# EAGLE board hub_keyboard (EAGLE 9.2.1)
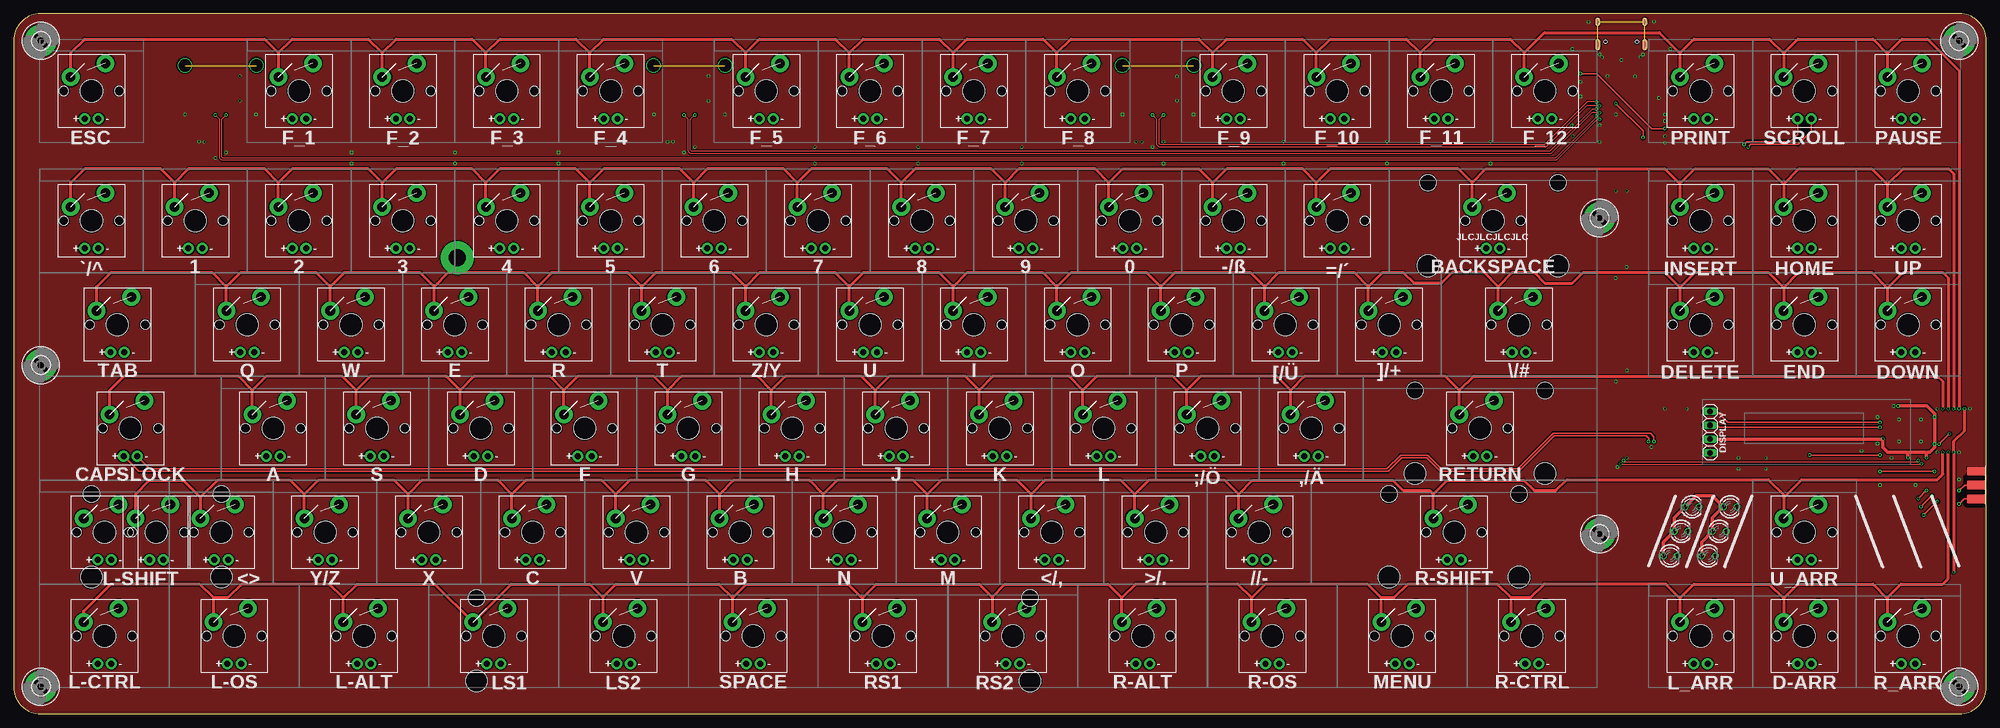
[diagram p4: board, top side]
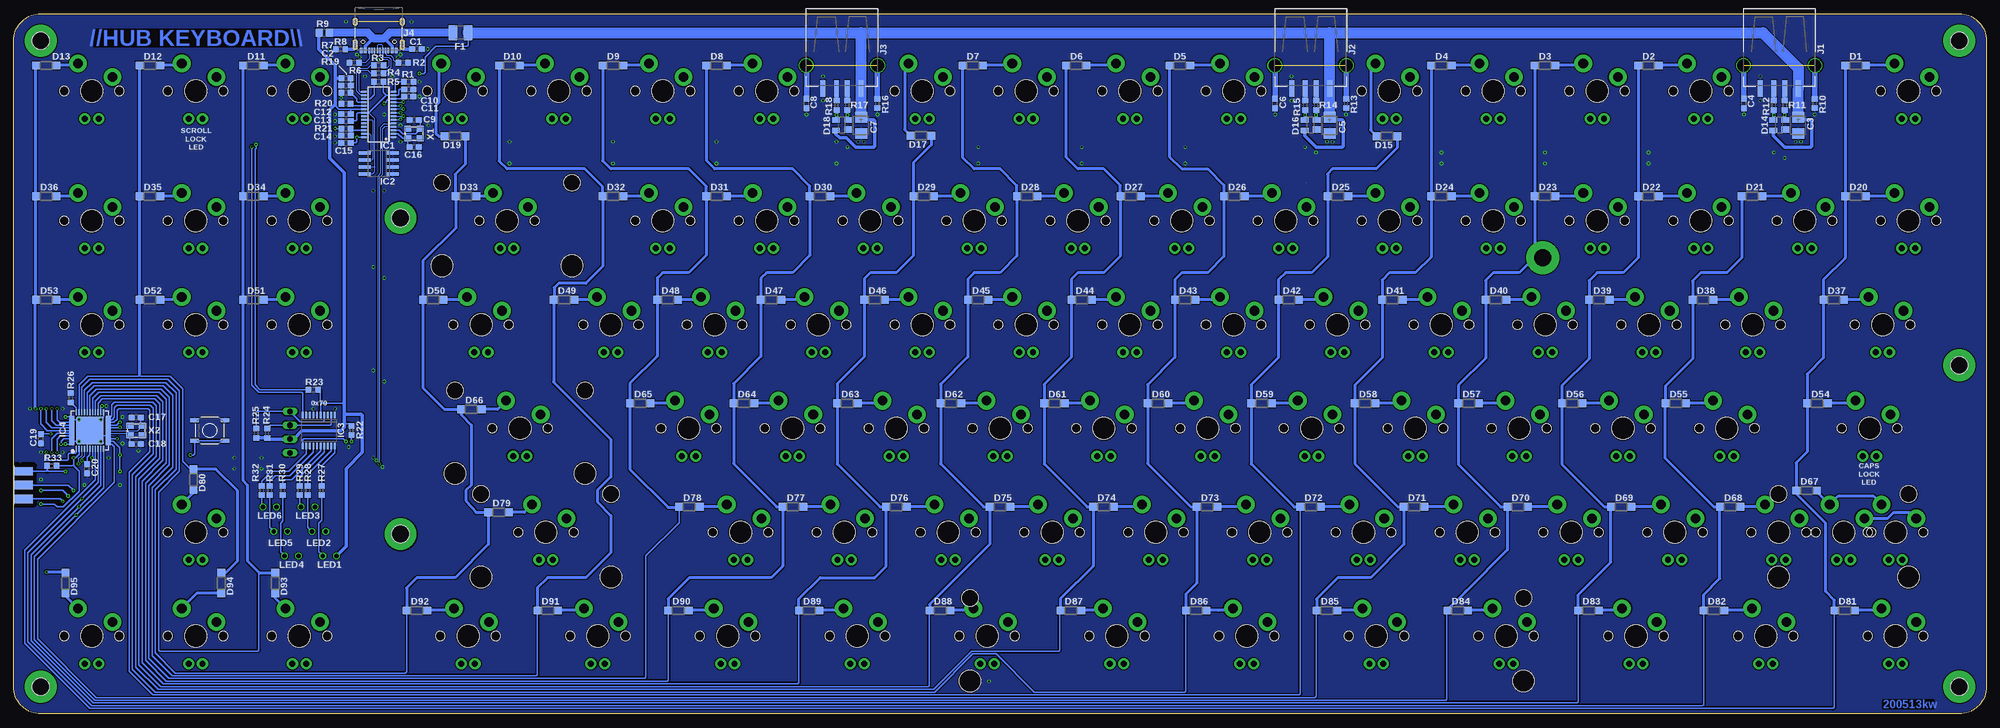
[diagram p5: board, bottom side, seen from below]

Size 362 x 128.5 mm. Coordinates in mm from the lower left corner, seen from the top.
Outline: 357,128.5 5,128.5 arc90 0,123.5 0,5 arc90 5,0 357,0 arc90 362,5 362,123.5 arc90 357,128.5
Copper layers (1*16): Top 0.035mm / dielectric 1.5mm / Bottom 0.035mm
Design rules "JLCPCB_2Layer": minimum track width 3.5mil, minimum drill 0.2mm, track to track 3.5mil, track to pad 5mil, pad to pad 5mil, via to via 5mil, smd to smd 3.5mil, copper to edge 0.2mm, drill to drill 0.2mm, minimum pad ring 0.2mm, minimum via ring 0.15mm, stop-mask expansion 0.075mm, vias tented up to drill 0.3mm, thermal gap 0.2mm
Holes 3.2 mm at 5,5 5,123.5 291,33 357,5 357,123.5 291,91 5,64
tRestrict: 6 lines
bRestrict: 8 lines

## Footprints (pad centres in the part's own frame; a part is rotated, then mirrored left to right if it is on the bottom)
CHERRY-MX-LED-1U = drill 1.092 pad 2.032: A 8.255,4.445; K 10.795,4.445 | drill 1.753 pad 3.226: S1 5.715,12.065; S2 12.065,14.605 | hole 4.089: 9.525,9.525 | hole 1.707: 4.445,9.525; 14.605,9.525
CHERRY-MX-LED-1.5U = drill 1.092 pad 2.032: A 13.018,4.445; K 15.557,4.445 | drill 1.753 pad 3.226: S1 10.477,12.065; S2 16.828,14.605 | hole 4.089: 14.287,9.525 | hole 1.707: 9.207,9.525; 19.367,9.525
CHERRY-MX-LED-1X2U = drill 1.092 pad 2.032: A 17.78,4.445; K 20.32,4.445 | drill 1.753 pad 3.226: S1 15.24,12.065; S2 21.59,14.605 | hole 4.089: 19.05,9.525 | hole 1.707: 13.97,9.525; 24.13,9.525
C0603 = smd 1.1 x 1: 1 -0.85,0; 2 0.85,0
CT3528 = smd 2 x 2.2: + -1.5,0; - 1.5,0
CHERRY-MX-LED-1.75U = drill 1.092 pad 2.032: A 15.405,4.445; K 17.945,4.445 | drill 1.753 pad 3.226: S1 12.865,12.065; S2 19.215,14.605 | hole 4.089: 16.675,9.525 | hole 1.707: 11.595,9.525; 21.755,9.525
SOD123 = smd 1.4 x 1.4: A 1.9,0; C -1.9,0
SOT143 = smd 1.2 x 1.44: 1 -0.75,-1.1 | smd 1 x 1.44: 2 0.95,-1.1; 3 0.95,1.1; 4 -0.95,1.1
128X32_I2C_OLED = drill 1.016 long: 1 0,-3.81; 2 0,-1.27; 3 0,1.27; 4 0,3.81
R1210 = smd 1.6 x 2.7: 1 -1.4,0; 2 1.4,0
3,2-PAD = drill 3.2 pad 5.842: B3,2 0,0
SSOP28 = smd 1 x 0.4: 1 -2.7,4.16; 2 -2.7,3.52; 3 -2.7,2.88; 4 -2.7,2.24; 5 -2.7,1.6; 6 -2.7,0.96; 7 -2.7,0.32; 8 -2.7,-0.32; 9 -2.7,-0.96; 10 -2.7,-1.6; 11 -2.7,-2.24; 12 -2.7,-2.88; 13 -2.7,-3.52; 14 -2.7,-4.16; 15 2.7,-4.16; 16 2.7,-3.52; 17 2.7,-2.88; 18 2.7,-2.24; 19 2.7,-1.6; 20 2.7,-0.96; 21 2.7,-0.32; 22 2.7,0.32; 23 2.7,0.96; 24 2.7,1.6; 25 2.7,2.24; 26 2.7,2.88; 27 2.7,3.52; 28 2.7,4.16
SO-08 = smd 0.6 x 2.2: 1 -1.905,-2.6; 2 -0.635,-2.6; 3 0.635,-2.6; 4 1.905,-2.6; 5 1.905,2.6; 6 0.635,2.6; 7 -0.635,2.6; 8 -1.905,2.6
SSOP20 = smd 0.35 x 1.2: 1 -2.925,-2.85; 2 -2.275,-2.85; 3 -1.625,-2.85; 4 -0.975,-2.85; 5 -0.325,-2.85; 6 0.325,-2.85; 7 0.975,-2.85; 8 1.625,-2.85; 9 2.275,-2.85; 10 2.925,-2.85; 11 2.925,2.85; 12 2.275,2.85; 13 1.625,2.85; 14 0.975,2.85; 15 0.325,2.85; 16 -0.325,2.85; 17 -0.975,2.85; 18 -1.625,2.85; 19 -2.275,2.85; 20 -2.925,2.85
QFN44G-0.5-7X7MM = smd 1 x 0.3: 1 -3.35,2.5; 2 -3.35,2; 3 -3.35,1.5; 4 -3.35,1; 5 -3.35,0.5; 6 -3.35,0; 7 -3.35,-0.5; 8 -3.35,-1; 9 -3.35,-1.5; 10 -3.35,-2; 11 -3.35,-2.5; 23 3.35,-2.5; 24 3.35,-2; 25 3.35,-1.5; 26 3.35,-1; 27 3.35,-0.5; 28 3.35,0; 29 3.35,0.5; 30 3.35,1; 31 3.35,1.5; 32 3.35,2; 33 3.35,2.5 | smd 0.3 x 1: 12 -2.5,-3.35; 13 -2,-3.35; 14 -1.5,-3.35; 15 -1,-3.35; 16 -0.5,-3.35; 17 0,-3.35; 18 0.5,-3.35; 19 1,-3.35; 20 1.5,-3.35; 21 2,-3.35; 22 2.5,-3.35; 34 2.5,3.35; 35 2,3.35; 36 1.5,3.35; 37 1,3.35; 38 0.5,3.35; 39 0,3.35; 40 -0.5,3.35; 41 -1,3.35; 42 -1.5,3.35; 43 -2,3.35; 44 -2.5,3.35 | smd 5.08 x 5.08: TAB 0,0
6PAD_ISP = smd 1.524 x 3.302 bottom: GND 2.54,0; MOSI 0,0; VCC -2.54,0 | smd 1.524 x 3.302: MISO -2.54,0; RST 2.54,0; SCK 0,0
USB-A-S-SILK-FEMALE = smd 3 x 0.9: D+ 7.212,-1; D- 7.212,1; GND 7.212,-3.5; VBUS 7.212,3.5 | drill 2.311: SHLD1 3,-6.566; SHLD2 3,6.566
USB-C-16P = smd 0.3 x 1.016: A5 -1.25,0.154; A6 -0.25,0.154; A7 0.25,0.154; A8 1.25,0.154; B5 1.75,0.154; B6 0.75,0.154; B7 -0.75,0.154; B8 -1.75,0.154 | smd 0.6 x 1.016: GND -3.225,0.154; GND2 3.225,0.154 | smd 1 x 2.1: SHLD1 -4.32,-0.915; SHLD2 4.32,-0.915 | smd 1 x 2.1 bottom: SHLD3 -4.32,-0.915; SHLD4 4.32,-0.915 | smd 1 x 1.6: SHLD5 -4.32,-5.095; SHLD8 4.32,-5.095 | smd 1 x 1.6 bottom: SHLD6 -4.32,-5.095; SHLD7 4.32,-5.095 | smd 0.55 x 1.016: VBUS1 -2.45,0.154; VBUS2 2.45,0.154 | hole 0.65: -2.89,-1.445; 2.89,-1.445
CHERRY-MX-LED-1.25U = drill 1.092 pad 2.032: A 10.643,4.445; K 13.183,4.445 | drill 1.753 pad 3.226: S1 8.103,12.065; S2 14.453,14.605 | hole 4.089: 11.913,9.525 | hole 1.707: 6.833,9.525; 16.993,9.525
CHERRY-MX-LED-1X2.25 = drill 1.092 pad 2.032: A 20.168,4.445; K 22.708,4.445 | drill 1.753 pad 3.226: S1 17.628,12.065; S2 23.978,14.605 | hole 4.089: 21.438,9.525 | hole 1.707: 16.358,9.525; 26.518,9.525
LED3MM = drill 0.813 octagon: A -1.27,0; K 1.27,0
R0603 = smd 1 x 1.1: 1 -0.85,0; 2 0.85,0
R0805 = smd 1.3 x 1.5: 1 -0.95,0; 2 0.95,0
CHERRY-MX-LED-1X2.75 = drill 1.092 pad 2.032: A 24.93,4.445; K 27.47,4.445 | drill 1.753 pad 3.226: S1 22.39,12.065; S2 28.74,14.605 | hole 4.089: 26.2,9.525 | hole 1.707: 21.12,9.525; 31.28,9.525
TACTILE_SWITCH_SMD_5.2MM = smd 1.524 x 0.762: 1 -2.794,1.905; 2 2.794,1.905; 3 -2.794,-1.905; 4 2.794,-1.905
STABILIZER_1X2U = hole 3.048: 7.112,16.51; 30.988,16.51 | hole 3.988: 7.112,1.27; 30.988,1.27
STABILIZER_1X2.25U = hole 3.988: 9.5,1.27; 33.376,1.27 | hole 3.048: 9.5,16.51; 33.376,16.51
STABILIZER_1X2.75U = hole 3.048: 14.262,16.51; 38.138,16.51 | hole 3.988: 14.262,1.27; 38.138,1.27
STABILIZER_1X6.25U = hole 3.988: 8.738,1.27; 110.338,1.27 | hole 3.048: 110.338,16.51; 8.738,16.51
CHERRY-MX-LED-1X6.25 = drill 1.092 pad 2.032: A 58.268,4.445; K 60.808,4.445 | drill 1.753 pad 3.226: S1 55.728,12.065; S2 62.078,14.605 | hole 4.089: 59.538,9.525 | hole 1.707: 54.458,9.525; 64.618,9.525
3.2X2.5_KX-7 = smd 1.3 x 1.1: 1 -1.15,-0.9; 2 1.15,-0.9; 3 1.15,0.9; 4 -1.15,0.9

## Placement (x,y rotation side)
0  MECHANICAL-KEYBOARD1U  [CHERRY-MX-LED-1U]  195.26,80.96 0 top
1  MECHANICAL-KEYBOARD1U  [CHERRY-MX-LED-1U]  23.81,80.96 0 top
2  MECHANICAL-KEYBOARD1U  [CHERRY-MX-LED-1U]  42.86,80.96 0 top
3  MECHANICAL-KEYBOARD1U  [CHERRY-MX-LED-1U]  61.91,80.96 0 top
4  MECHANICAL-KEYBOARD1U  [CHERRY-MX-LED-1U]  80.96,80.96 0 top
5  MECHANICAL-KEYBOARD1U  [CHERRY-MX-LED-1U]  100.01,80.96 0 top
6  MECHANICAL-KEYBOARD1U  [CHERRY-MX-LED-1U]  119.06,80.96 0 top
7  MECHANICAL-KEYBOARD1U  [CHERRY-MX-LED-1U]  138.11,80.96 0 top
8  MECHANICAL-KEYBOARD1U  [CHERRY-MX-LED-1U]  157.16,80.96 0 top
9  MECHANICAL-KEYBOARD1U  [CHERRY-MX-LED-1U]  176.21,80.96 0 top
,/Ä  MECHANICAL-KEYBOARD1U  [CHERRY-MX-LED-1U]  228.6,42.86 0 top
-/ß  MECHANICAL-KEYBOARD1U  [CHERRY-MX-LED-1U]  214.31,80.96 0 top
.  MECHANICAL-KEYBOARD1U  [CHERRY-MX-LED-1U]  209.55,42.86 0 top
//-  MECHANICAL-KEYBOARD1U  [CHERRY-MX-LED-1U]  219.07,23.81 0 top
</,  MECHANICAL-KEYBOARD1U  [CHERRY-MX-LED-1U]  180.97,23.81 0 top
<>  MECHANICAL-KEYBOARD1U  [CHERRY-MX-LED-1U]  28.57,23.81 0 top
=/´  MECHANICAL-KEYBOARD1U  [CHERRY-MX-LED-1U]  233.36,80.96 0 top
>/.  MECHANICAL-KEYBOARD1U  [CHERRY-MX-LED-1U]  200.03,23.81 0 top
[/Ü  MECHANICAL-KEYBOARD1U  [CHERRY-MX-LED-1U]  223.84,61.91 0 top
\\/#  MECHANICAL-KEYBOARD1.5U  [CHERRY-MX-LED-1.5U]  261.94,61.91 0 top
]/+  MECHANICAL-KEYBOARD1U  [CHERRY-MX-LED-1U]  242.89,61.91 0 top
`/^  MECHANICAL-KEYBOARD1U  [CHERRY-MX-LED-1U]  4.76,80.96 0 top
A  MECHANICAL-KEYBOARD1U  [CHERRY-MX-LED-1U]  38.1,42.86 0 top
B  MECHANICAL-KEYBOARD1U  [CHERRY-MX-LED-1U]  123.83,23.81 0 top
BACKSPACE  MECHANICAL-KEYBOARD2U  [CHERRY-MX-LED-1X2U]  252.41,80.96 0 top
C  MECHANICAL-KEYBOARD1U  [CHERRY-MX-LED-1U]  85.72,23.81 0 top
C1  10n 100V  [C0603]  288,122 180 bottom
C2  100nF  [C0603]  301,115.3 0 bottom
C3  100uF  [CT3528]  34.5,108 270 bottom
C4  10n 100V  [C0603]  44.5,112 90 bottom
C5  100uF  [CT3528]  120.5,108 270 bottom
C6  10n 100V  [C0603]  130.5,112 90 bottom
C7  100uF  [CT3528]  206.5,108 270 bottom
C8  10n 100V  [C0603]  216.5,112 90 bottom
C9  12pF  [C0603]  288.5,109 180 bottom
C10  100nF  [C0603]  289.5,114.6 180 bottom
C11  10u  [C0603]  289.5,113.3 180 bottom
C12  10u  [C0603]  301,110.1 0 bottom
C13  10u  [C0603]  301,108.8 0 bottom
C14  10n  [C0603]  301,106.1 0 bottom
C15  100nF  [C0603]  301,104.8 0 bottom
C16  12pF  [C0603]  288.5,104 0 bottom
C17  12pF  [C0603]  339.5,54.4 180 bottom
C18  12pF  [C0603]  339.5,49.5 0 bottom
C19  100nF  [C0603]  357,50.5 90 bottom
C20  1u  [C0603]  348.5,45 90 bottom
CAPSLOCK  MECHANICAL-KEYBOARD1.75U  [CHERRY-MX-LED-1.75U]  4.76,42.86 0 top
D  MECHANICAL-KEYBOARD1U  [CHERRY-MX-LED-1U]  76.2,42.86 0 top
D1  1N4148  [SOD123]  24,119 0 bottom
D2  1N4148  [SOD123]  62,119 0 bottom
D3  1N4148  [SOD123]  81,119 0 bottom
D4  1N4148  [SOD123]  100,119 0 bottom
D5  1N4148  [SOD123]  148,119 0 bottom
D6  1N4148  [SOD123]  167,119 0 bottom
D7  1N4148  [SOD123]  186,119 0 bottom
D8  1N4148  [SOD123]  233,119 0 bottom
D9  1N4148  [SOD123]  252,119 0 bottom
D10  1N4148  [SOD123]  271,119 0 bottom
D11  1N4148  [SOD123]  318,119 0 bottom
D12  1N4148  [SOD123]  337,119 0 bottom
D13  1N4148  [SOD123]  356,119 0 bottom
D14  PRTR5V0U2X  [SOT143]  38,108 90 bottom
D15  1N4148  [SOD123]  110,106 180 bottom
D16  PRTR5V0U2X  [SOT143]  124,108 90 bottom
D17  1N4148  [SOD123]  195.5,106.1 180 bottom
D18  PRTR5V0U2X  [SOT143]  210,108 90 bottom
D19  1N4148  [SOD123]  281,106 180 bottom
D20  1N4148  [SOD123]  24,95 0 bottom
D21  1N4148  [SOD123]  43,95 0 bottom
D22  1N4148  [SOD123]  62,95 0 bottom
D23  1N4148  [SOD123]  81,95 0 bottom
D24  1N4148  [SOD123]  100,95 0 bottom
D25  1N4148  [SOD123]  119,95 0 bottom
D26  1N4148  [SOD123]  138,95 0 bottom
D27  1N4148  [SOD123]  157,95 0 bottom
D28  1N4148  [SOD123]  176,95 0 bottom
D29  1N4148  [SOD123]  195,95 0 bottom
D30  1N4148  [SOD123]  214,95 0 bottom
D31  1N4148  [SOD123]  233,95 0 bottom
D32  1N4148  [SOD123]  252,95 0 bottom
D33  1N4148  [SOD123]  279,95 0 bottom
D34  1N4148  [SOD123]  318,95 0 bottom
D35  1N4148  [SOD123]  337,95 0 bottom
D36  1N4148  [SOD123]  356,95 0 bottom
D37  1N4148  [SOD123]  28,76 0 bottom
D38  1N4148  [SOD123]  52,76 0 bottom
D39  1N4148  [SOD123]  71,76 0 bottom
D40  1N4148  [SOD123]  90,76 0 bottom
D41  1N4148  [SOD123]  109,76 0 bottom
D42  1N4148  [SOD123]  128,76 0 bottom
D43  1N4148  [SOD123]  147,76 0 bottom
D44  1N4148  [SOD123]  166,76 0 bottom
D45  1N4148  [SOD123]  185,76 0 bottom
D46  1N4148  [SOD123]  204,76 0 bottom
D47  1N4148  [SOD123]  223,76 0 bottom
D48  1N4148  [SOD123]  242,76 0 bottom
D49  1N4148  [SOD123]  261,76 0 bottom
D50  1N4148  [SOD123]  285,76 0 bottom
D51  1N4148  [SOD123]  318,76 0 bottom
D52  1N4148  [SOD123]  337,76 0 bottom
D53  1N4148  [SOD123]  356,76 0 bottom
D54  1N4148  [SOD123]  31,57 0 bottom
D55  1N4148  [SOD123]  57,57 0 bottom
D56  1N4148  [SOD123]  76,57 0 bottom
D57  1N4148  [SOD123]  95,57 0 bottom
D58  1N4148  [SOD123]  114,57 0 bottom
D59  1N4148  [SOD123]  133,57 0 bottom
D60  1N4148  [SOD123]  152,57 0 bottom
D61  1N4148  [SOD123]  171,57 0 bottom
D62  1N4148  [SOD123]  190,57 0 bottom
D63  1N4148  [SOD123]  209,57 0 bottom
D64  1N4148  [SOD123]  228,57 0 bottom
D65  1N4148  [SOD123]  247,57 0 bottom
D66  1N4148  [SOD123]  278,55.9 0 bottom
D67  1N4148  [SOD123]  33,41 0 bottom
D68  1N4148  [SOD123]  47,38 0 bottom
D69  1N4148  [SOD123]  67,38 0 bottom
D70  1N4148  [SOD123]  86,38 0 bottom
D71  1N4148  [SOD123]  105,38 0 bottom
D72  1N4148  [SOD123]  124,38 0 bottom
D73  1N4148  [SOD123]  143,38 0 bottom
D74  1N4148  [SOD123]  162,38 0 bottom
D75  1N4148  [SOD123]  181,38 0 bottom
D76  1N4148  [SOD123]  200,38 0 bottom
D77  1N4148  [SOD123]  219,38 0 bottom
D78  1N4148  [SOD123]  238,38 0 bottom
D79  1N4148  [SOD123]  273,37 0 bottom
D80  1N4148  [SOD123]  329,43 270 bottom
D81  1N4148  [SOD123]  26,19 0 bottom
D82  1N4148  [SOD123]  50,19 0 bottom
D83  1N4148  [SOD123]  73,19 0 bottom
D84  1N4148  [SOD123]  97,19 0 bottom
D85  1N4148  [SOD123]  121,19 0 bottom
D86  1N4148  [SOD123]  145,19 0 bottom
D87  1N4148  [SOD123]  168,19 0 bottom
D88  1N4148  [SOD123]  192,19 0 bottom
D89  1N4148  [SOD123]  216,19 0 bottom
D90  1N4148  [SOD123]  240,19 0 bottom
D91  1N4148  [SOD123]  264,19 0 bottom
D92  1N4148  [SOD123]  288,19 0 bottom
D93  1N4148  [SOD123]  314,24 270 bottom
D94  1N4148  [SOD123]  323.9,24 270 bottom
D95  1N4148  [SOD123]  352.5,24 270 bottom
D-ARR  MECHANICAL-KEYBOARD1U  [CHERRY-MX-LED-1U]  319.09,4.76 0 top
DELETE  MECHANICAL-KEYBOARD1U  [CHERRY-MX-LED-1U]  300.04,61.91 0 top
DISPLAY  I2C_OLED_128X32  [128X32_I2C_OLED]  311.3,51.7 0 top
DOWN  MECHANICAL-KEYBOARD1U  [CHERRY-MX-LED-1U]  338.14,61.91 0 top
E  MECHANICAL-KEYBOARD1U  [CHERRY-MX-LED-1U]  71.44,61.91 0 top
END  MECHANICAL-KEYBOARD1U  [CHERRY-MX-LED-1U]  319.09,61.91 0 top
ESC  MECHANICAL-KEYBOARD1U  [CHERRY-MX-LED-1U]  4.76,104.78 0 top
F  MECHANICAL-KEYBOARD1U  [CHERRY-MX-LED-1U]  95.25,42.86 0 top
F1  1.1A Hold  [R1210]  280,125 180 bottom
F_1  MECHANICAL-KEYBOARD1U  [CHERRY-MX-LED-1U]  42.86,104.78 0 top
F_2  MECHANICAL-KEYBOARD1U  [CHERRY-MX-LED-1U]  61.91,104.78 0 top
F_3  MECHANICAL-KEYBOARD1U  [CHERRY-MX-LED-1U]  80.96,104.78 0 top
F_4  MECHANICAL-KEYBOARD1U  [CHERRY-MX-LED-1U]  100.01,104.78 0 top
F_5  MECHANICAL-KEYBOARD1U  [CHERRY-MX-LED-1U]  128.59,104.78 0 top
F_6  MECHANICAL-KEYBOARD1U  [CHERRY-MX-LED-1U]  147.64,104.78 0 top
F_7  MECHANICAL-KEYBOARD1U  [CHERRY-MX-LED-1U]  166.69,104.78 0 top
F_8  MECHANICAL-KEYBOARD1U  [CHERRY-MX-LED-1U]  185.74,104.78 0 top
F_9  MECHANICAL-KEYBOARD1U  [CHERRY-MX-LED-1U]  214.31,104.78 0 top
F_10  MECHANICAL-KEYBOARD1U  [CHERRY-MX-LED-1U]  233.36,104.78 0 top
F_11  MECHANICAL-KEYBOARD1U  [CHERRY-MX-LED-1U]  252.41,104.78 0 top
F_12  MECHANICAL-KEYBOARD1U  [CHERRY-MX-LED-1U]  271.46,104.78 0 top
G  MECHANICAL-KEYBOARD1U  [CHERRY-MX-LED-1U]  114.3,42.86 0 top
H  MECHANICAL-KEYBOARD1U  [CHERRY-MX-LED-1U]  133.35,42.86 0 top
H1  MOUNT-PAD-ROUND3.2  [3,2-PAD]  5,123.5 0 top
H2  MOUNT-PAD-ROUND3.2  [3,2-PAD]  357,123.5 0 top
H3  MOUNT-PAD-ROUND3.2  [3,2-PAD]  291,91 0 top
H4  MOUNT-PAD-ROUND3.2  [3,2-PAD]  5,64 0 top
H5  MOUNT-PAD-ROUND3.2  [3,2-PAD]  291,33 0 top
H6  MOUNT-PAD-ROUND3.2  [3,2-PAD]  5,5 0 top
H7  MOUNT-PAD-ROUND3.2  [3,2-PAD]  357,5 0 top
HOME  MECHANICAL-KEYBOARD1U  [CHERRY-MX-LED-1U]  319.09,80.96 0 top
I  MECHANICAL-KEYBOARD1U  [CHERRY-MX-LED-1U]  166.69,61.91 0 top
IC1  FE1.1S  [SSOP28]  295,110 180 bottom
IC2  24LC024SN  [SO-08]  295,101 90 bottom
IC3  PCF8574APWR  [SSOP20]  306,52 180 bottom
IC4  ATMEGA32U4-MU  [QFN44G-0.5-7X7MM]  348,52 90 bottom
INSERT  MECHANICAL-KEYBOARD1U  [CHERRY-MX-LED-1U]  300.04,80.96 0 top
ISP  AVR-ISP-6-EDGE  [6PAD_ISP]  360.1,42 90 bottom
J  MECHANICAL-KEYBOARD1U  [CHERRY-MX-LED-1U]  152.4,42.86 0 top
J1  USB_A_SMT_FEMALE  [USB-A-S-SILK-FEMALE]  38,122 270 bottom
J2  USB_A_SMT_FEMALE  [USB-A-S-SILK-FEMALE]  124,122 270 bottom
J3  USB_A_SMT_FEMALE  [USB-A-S-SILK-FEMALE]  210,122 270 bottom
J4  [USB-C-16P]  295,121.9 180 bottom
K  MECHANICAL-KEYBOARD1U  [CHERRY-MX-LED-1U]  171.45,42.86 0 top
L  MECHANICAL-KEYBOARD1U  [CHERRY-MX-LED-1U]  190.5,42.86 0 top
L-ALT  MECHANICAL-KEYBOARD1.25U  [CHERRY-MX-LED-1.25U]  52.39,4.76 0 top
L-CTRL  MECHANICAL-KEYBOARD1.25U  [CHERRY-MX-LED-1.25U]  4.76,4.76 0 top
L-OS  MECHANICAL-KEYBOARD1.25U  [CHERRY-MX-LED-1.25U]  28.57,4.76 0 top
L-SHIFT  MECHANICAL-KEYBOARD2.25U  [CHERRY-MX-LED-1X2.25]  4.76,23.81 0 top
L-SHIFT1  MECHANICAL-KEYBOARD1.25U  [CHERRY-MX-LED-1.25U]  4.76,23.81 0 top
L_ARR  MECHANICAL-KEYBOARD1U  [CHERRY-MX-LED-1U]  300.04,4.76 0 top
LED1  [LED3MM]  304,29 0 top
LED2  [LED3MM]  306,33.5 0 top
LED3  [LED3MM]  308,38 0 top
LED4  [LED3MM]  311,29 0 top
LED5  [LED3MM]  313,33.5 0 top
LED6  [LED3MM]  315,38 0 top
LS1  MECHANICAL-KEYBOARD1.25U  [CHERRY-MX-LED-1.25U]  76.2,4.76 0 top
LS2  MECHANICAL-KEYBOARD1.25U  [CHERRY-MX-LED-1.25U]  100.01,4.76 0 top
M  MECHANICAL-KEYBOARD1U  [CHERRY-MX-LED-1U]  161.93,23.81 0 top
MENU  MECHANICAL-KEYBOARD1.25U  [CHERRY-MX-LED-1.25U]  242.89,4.76 0 top
N  MECHANICAL-KEYBOARD1U  [CHERRY-MX-LED-1U]  142.88,23.81 0 top
O  MECHANICAL-KEYBOARD1U  [CHERRY-MX-LED-1U]  185.74,61.91 0 top
P  MECHANICAL-KEYBOARD1U  [CHERRY-MX-LED-1U]  204.79,61.91 0 top
PAUSE  MECHANICAL-KEYBOARD1U  [CHERRY-MX-LED-1U]  338.14,104.78 0 top
PRINT  MECHANICAL-KEYBOARD1U  [CHERRY-MX-LED-1U]  300.04,104.78 0 top
Q  MECHANICAL-KEYBOARD1U  [CHERRY-MX-LED-1U]  33.34,61.91 0 top
R  MECHANICAL-KEYBOARD1U  [CHERRY-MX-LED-1U]  90.49,61.91 0 top
R1  2k7  [R0603]  289.5,116 180 bottom
R2  5k1  [R0603]  290.5,119.5 180 bottom
R3  22R  [R0603]  295,119 0 bottom
R4  22R  [R0603]  295,117.6 0 bottom
R5  20k  [R0603]  295,116 180 bottom
R6  5k1  [R0603]  299.5,119.5 0 bottom
R7  10k  [R0603]  301,116.6 180 bottom
R8  1M  [R0603]  302,122 180 bottom
R9  Ferrite 2A  [R0805]  305,125 0 bottom
R10  1M  [R0603]  31.5,112 270 bottom
R11  22R  [R0603]  37,111.7 90 bottom
R12  22R  [R0603]  39,111.7 90 bottom
R13  1M  [R0603]  117.5,112 270 bottom
R14  22R  [R0603]  123,111.7 90 bottom
R15  22R  [R0603]  125,111.7 90 bottom
R16  1M  [R0603]  203.5,112 270 bottom
R17  22R  [R0603]  209,111.7 90 bottom
R18  22R  [R0603]  211,111.7 90 bottom
R19  100k  [R0603]  301,114 0 bottom
R20  10k  [R0603]  301,112 180 bottom
R21  10k  [R0603]  301,107.4 180 bottom
R22  1k  [R0603]  300,52 90 bottom
R23  1k  [R0603]  307,59.5 0 bottom
R24  20k  [R0603]  315.5,51.5 90 bottom
R25  20k  [R0603]  317.5,51.5 90 bottom
R26  1k  [R0603]  351.5,58 270 bottom
R27  1k  [R0603]  305.5,41 270 bottom
R28  1k  [R0603]  308,41 270 bottom
R29  1k  [R0603]  309.5,41 270 bottom
R30  1k  [R0603]  312.6,41 270 bottom
R31  1k  [R0603]  315,41 270 bottom
R32  1k  [R0603]  316.5,41 270 bottom
R33  10k  [R0603]  355,45.5 180 bottom
R-ALT  MECHANICAL-KEYBOARD1.25U  [CHERRY-MX-LED-1.25U]  195.26,4.76 0 top
R-CTRL  MECHANICAL-KEYBOARD1.25U  [CHERRY-MX-LED-1.25U]  266.7,4.76 0 top
R-OS  MECHANICAL-KEYBOARD1.25U  [CHERRY-MX-LED-1.25U]  219.07,4.76 0 top
R-SHIFT  MECHANICAL-KEYBOARD2.75U  [CHERRY-MX-LED-1X2.75]  238.12,23.81 0 top
R_ARR  MECHANICAL-KEYBOARD1U  [CHERRY-MX-LED-1U]  338.14,4.76 0 top
RESET  MOMENTARY-SWITCH-SPST-SMD-5.2-REDUNDANT  [TACTILE_SWITCH_SMD_5.2MM]  326,52 180 bottom
RETURN  MECHANICAL-KEYBOARD2.25U  [CHERRY-MX-LED-1X2.25]  247.65,42.86 0 top
RS1  MECHANICAL-KEYBOARD1.25U  [CHERRY-MX-LED-1.25U]  147.64,4.76 0 top
RS2  MECHANICAL-KEYBOARD1.25U  [CHERRY-MX-LED-1.25U]  171.45,4.76 0 top
S  MECHANICAL-KEYBOARD1U  [CHERRY-MX-LED-1U]  57.15,42.86 0 top
S1  STABILIZER-1X2U  [STABILIZER_1X2U]  252.41,80.96 0 top
S2  STABILIZER-1X2.25U  [STABILIZER_1X2.25U]  247.65,42.86 0 top
S3  STABILIZER-1X2.25U  [STABILIZER_1X2.25U]  4.76,23.81 0 top
S4  STABILIZER-1X2.75U  [STABILIZER_1X2.75U]  238.12,23.81 0 top
S5  STABILIZER-1X6.25U  [STABILIZER_1X6.25U]  76.2,4.76 0 top
SCROLL  MECHANICAL-KEYBOARD1U  [CHERRY-MX-LED-1U]  319.09,104.78 0 top
SPACE  MECHANICAL-KEYBOARD6.25U  [CHERRY-MX-LED-1X6.25]  76.2,4.76 0 top
T  MECHANICAL-KEYBOARD1U  [CHERRY-MX-LED-1U]  109.54,61.91 0 top
TAB  MECHANICAL-KEYBOARD1.5U  [CHERRY-MX-LED-1.5U]  4.76,61.91 0 top
U  MECHANICAL-KEYBOARD1U  [CHERRY-MX-LED-1U]  147.64,61.91 0 top
U_ARR  MECHANICAL-KEYBOARD1U  [CHERRY-MX-LED-1U]  319.09,23.81 0 top
UP  MECHANICAL-KEYBOARD1U  [CHERRY-MX-LED-1U]  338.14,80.96 0 top
V  MECHANICAL-KEYBOARD1U  [CHERRY-MX-LED-1U]  104.78,23.81 0 top
W  MECHANICAL-KEYBOARD1U  [CHERRY-MX-LED-1U]  52.39,61.91 0 top
X  MECHANICAL-KEYBOARD1U  [CHERRY-MX-LED-1U]  66.67,23.81 0 top
X1  12MHz  [3.2X2.5_KX-7]  288.5,106.5 0 bottom
X2  16MHz  [3.2X2.5_KX-7]  339.5,52 0 bottom
Y/Z  MECHANICAL-KEYBOARD1U  [CHERRY-MX-LED-1U]  47.62,23.81 0 top
Z/Y  MECHANICAL-KEYBOARD1U  [CHERRY-MX-LED-1U]  128.59,61.91 0 top

## Tracks (layer width: path | path; a pad name or v marks a point on that pad's centre or on a via)
1V8_HUB  (via drill 0.3)
  Top 0.3: v294,112 299,107 v299,105.8
  Bottom 0.3: C11.2 290.77,112.88 IC1.12 293.12,112.88 v294,112 | IC1.28 298.96,105.84 v299,105.8 299,105 299.2,104.8 C15.2
3V3_HUB
  Bottom 0.2: IC2.8 296.1,99.09 295.7,99.5 295.7,100.3 | IC2.7 295.76,100.36 295.7,100.3 | 296.8,110.32 295.7,109.22 295.7,100.3
  Bottom 0.3: C10.2 291.1,114.6 291.3,114.4 291.3,113.72 291.5,113.52 IC1.13 293.6,113.52 | C13.2 299.2,108.8 299,109 299,110.12 298.8,110.32 IC1.21 296.8,110.32 293.6,113.52 | 293.6,113.52 294.15,114.07 R5.1
C1
  Bottom 0.3: D81.C 27.9,1.2 28.1,1 348,1 360,13 360,30 347,43 IC4.8
  Bottom 0.508: D81.C 27.9,20.88 29.5,22.48 29.5,35 35.1,40.6 35.1,40.8 D67.C 34.9,46.06 32.9,48.06 D54.C 32.9,62.35 29.9,65.35 D37.C 29.9,79.64 25.9,83.64 D20.C 25.81,95.09 25.81,118.91 D1.C 25.7,119.2
C2/SCK  (via drill 0.3)
  Top 0.3: v351,41 v349.5,39.5
  Bottom 0.3: D82.C 51.9,1.7 52.1,1.5 347.7,1.5 359.4,13.2 359.4,29.6 v349.5,39.5 346.5,42.5 IC4.9 | ISP.SCK 352,42 v351,41
  Bottom 0.508: D21.C 44.9,83.69 47.62,80.96 52.39,80.96 53.9,79.45 D38.C 53.9,65.16 58.9,60.16 D55.C 59,56.9 59,47 50,38 D68.C 48.9,24.86 51.9,21.86 D82.C
C3/MOSI  (via drill 0.3)
  Top 0.3: ISP.MOSI 358,42 v357,41 | v352,40 v350,38
  Bottom 0.3: D83.C 74.9,2.2 75.1,2 347.4,2 358.8,13.4 358.8,29.2 v350,38 346,42 IC4.10 | v357,41 353,41 v352,40
  Bottom 0.508: D2.C D22.C 63.9,83.74 66.67,80.96 71.44,80.96 72.9,79.5 D39.C 72.9,65.21 77.9,60.21 D56.C 77.9,45.83 70.08,38 D69.C 68.9,27.85 74.9,21.85 D83.C
C4/MISO  (via drill 0.3)
  Top 0.3: v353,39 v350.5,36.5
  Bottom 0.3: IC4.11 345.5,41.5 v350.5,36.5 358.2,28.8 358.2,13.6 347.1,2.5 99.2,2.5 99,2.7 99,18.9 D84.C | ISP.MISO 353.46,39.46 v353,39
  Bottom 0.508: D3.C D23.C 82.9,83.79 85.72,80.96 90.49,80.96 91.9,79.55 D40.C 91.9,65.26 96.9,60.26 D57.C 96.9,45.77 89.12,38 D70.C 87.9,30.1 95.45,22.55 95.65,22.35 98.9,19.1 D84.C
C5
  Bottom 0.3: IC4.12 344,49.5 343.5,49 343.5,42.5 357.6,28.4 357.6,13.8 346.8,3 123.2,3 123,3.2 123,18.9 D85.C
  Bottom 0.508: D4.C D24.C 101.9,83.84 104.78,80.96 109.54,80.96 110.9,79.6 D41.C 110.9,65.31 115.9,60.31 D58.C 115.9,45.92 107.97,38 D71.C 106.9,31.1 113,25 119,25 122.9,21.1 D85.C
C6
  Bottom 0.3: IC4.20 343.6,53.5 343,54.1 343,55.7 342.7,56 337.3,56 337,55.7 337,48.1 340.8,44.3 340.8,7.8 336.5,3.5 126.1,3.5 125.9,3.7 D72.C
  Bottom 0.508: D15.C 108.1,103.9 112,100 120,100 120.9,99.1 D25.C 120.9,83.89 123.83,80.96 128.59,80.96 129.9,79.65 D42.C 129.9,65.36 134.9,60.36 D59.C 134.9,45.88 127.03,38 D72.C
C7
  Bottom 0.3: IC4.21 343.9,54 343.5,54.4 343.5,56.2 343.1,56.6 336.9,56.6 336.4,56.1 336.4,47.7 340.2,43.9 340.2,8.2 336,4 193,4 186,11 181.7,11 174.7,4 147.1,4 146.9,4.2 D86.C
  Bottom 0.508: D5.C 149.9,102.28 147.64,100.01 142.88,100.01 139.9,97.04 D26.C 139.9,83.94 142.88,80.96 147.64,80.96 148.9,79.7 D43.C 148.9,65.41 153.9,60.41 D60.C 153.9,45.92 145.97,38 D73.C 144.9,24 146.9,22 D86.C
C8
  Bottom 0.3: IC4.22 344.2,54.5 344,54.7 344,56.7 343.5,57.2 336.5,57.2 335.8,56.5 335.8,47.3 339.6,43.5 339.6,8.6 335.5,4.5 193.2,4.5 186.2,11.5 170.2,11.5 170,11.7 170,18.9 D87.C
  Bottom 0.508: D6.C 168.9,102.22 166.69,100.01 161.93,100.01 158.9,96.99 D27.C 158.9,83.99 161.93,80.96 166.69,80.96 167.9,79.75 D44.C 167.9,65.46 172.9,60.46 D61.C 172.9,45.9 165,38 D74.C 163.9,27.1 169.9,21.1 D87.C
C9
  Bottom 0.3: IC4.25 346.5,57 345.7,57.8 336.1,57.8 335.2,56.9 335.2,46.9 339,43.1 339,9 335,5 194.2,5 194,5.2 194,18.9 D88.C
  Bottom 0.508: D7.C 187.9,102.17 185.74,100.01 180.97,100.01 177.9,96.94 D28.C 177.9,84.04 180.97,80.96 185.74,80.96 186.9,79.8 D45.C 186.9,65.51 191.9,60.51 D62.C 191.9,45.9 184,38 D75.C 182.9,31.1 193.9,20.1 D88.C
C10
  Bottom 0.3: D89.C 217.9,5.7 218.1,5.5 334.5,5.5 338.4,9.4 338.4,42.7 334.6,46.5 334.6,57.3 335.7,58.4 346,58.4 347,57.4 IC4.26
  Bottom 0.508: D17.C 193.6,104.4 196.9,101.1 D29.C 196.9,84.09 200.03,80.96 204.79,80.96 205.9,79.85 D46.C 205.9,65.56 210.9,60.56 D63.C 210.9,45.9 203,38 D76.C 201.9,27.1 204,25 214,25 217.9,21.1 D89.C
C11
  Bottom 0.3: D90.C 241.9,6.2 242.1,6 334,6 337.8,9.8 337.8,42.3 334,46.1 334,57.7 335.3,59 346.4,59 347.5,57.9 IC4.27
  Bottom 0.508: D8.C 234.9,101.55 233.36,100.01 219.07,100.01 215.9,96.84 D30.C 215.9,84.14 219.07,80.96 223.84,80.96 224.9,79.9 D47.C 224.9,65.61 229.9,60.61 D64.C 229.9,45.92 221.97,38 D77.C 220.9,27.1 223,25 238,25 241.9,21.1 D90.C
C12
  Bottom 0.3: IC4.28 348,58.4 346.8,59.6 334.9,59.6 333.4,58.1 333.4,45.7 337.2,41.9 337.2,10.2 333.5,6.5 246.2,6.5 246,6.7 246,29 239.9,35.1 239.9,37.9 D78.C
  Bottom 0.508: D9.C 253.9,101.5 252.41,100.01 238.12,100.01 234.9,96.79 D31.C 234.9,84.19 238.12,80.96 242.89,80.96 243.9,79.95 D48.C 243.9,65.66 248.9,60.66 D65.C 248.9,44.9 241.9,37.9 239.9,37.9
C13
  Bottom 0.3: D91.C 265.9,7.2 266.1,7 332.9,7 336.6,10.7 336.6,41.5 332.8,45.3 332.8,58.5 334.5,60.2 347.2,60.2 348.5,58.9 IC4.29
  Bottom 0.508: D91.C 265.9,23.11 264,25.01 256.98,25.01 252.41,29.57 252.4,36.4 254.9,38.9 254.9,41 252.41,43.49 252.41,50.39 262.9,60.88 D49.C 262.8,76.1 262.8,78.2 262,79 257,79 253.9,82.1 D32.C 253.9,96.74 257.18,100.01 271.46,100.01 272.9,101.45 D10.C
C14
  Bottom 0.3: D92.C 289.9,7.7 290.1,7.5 332.3,7.5 336,11.2 336,41.1 332.2,44.9 332.2,58.9 334.1,60.8 347.6,60.8 349,59.4 IC4.30
  Bottom 0.508: D92.C 289.9,23.11 288,25.01 280.99,25.01 274.9,31.1 D79.C 277.12,37 279,39.11 279,41 278,42 278,53 279.9,54.9 D66.C 282.94,55.9 286.9,59.86 D50.C 286.9,83.11 280.9,89.11 D33.C 281,95.1 281,99 279.1,100.9 D19.C
C15
  Bottom 0.3: IC4.31 349.5,59.9 348,61.4 333.7,61.4 331.6,59.3 331.6,44.5 335.4,40.7 335.4,11.7 335.2,11.5 317.2,11.5 317,11.7 317,25.8 316.9,25.9
  Bottom 0.508: D11.C D34.C D51.C 319.9,42.8 319.1,42 319.1,28.1 316.9,25.9 D93.C
C16
  Bottom 0.3: D80.C 329.5,44.9 331,46.4 331,59.7 333.3,62 338.7,62 338.9,62.2 339.1,62 348.4,62 350,60.4 IC4.32
  Bottom 0.508: D12.C D35.C D52.C 338.9,62.2 | D80.C 324.9,44.9 321,41 321,28 323.1,25.9 D94.C
C17  (via drill 0.3)
  Top 0.508: v356,26 v356,48 356,50 358,52 v358,56
  Bottom 0.3: IC4.1 350.5,48 350.7,47.8 351.8,47.8 352,47.6 352,46.7 352.2,46.5 355.8,46.5 356,46.7 v356,48
  Bottom 0.508: D13.C D36.C D53.C 358,75.9 v358,56 | D95.C 352.6,26 v356,26
CL_LED_A  (via drill 0.3)
  Top 0.3: CAPSLOCK.A 22.98,44.5 252.2,44.5 254.7,47 259.3,47 261.8,44.5 276.2,44.5 282.7,51 299.6,51 300,50.6 v300,50
  Bottom 0.3: v300,50 R22.1
CL_LED_C  (via drill 0.3)
  Top 0.3: CAPSLOCK.K 25.02,45 252,45 254.5,47.5 259.5,47.5 262,45 276,45 282.5,51.5 300.4,51.5 301,50.9 v301,50
  Bottom 0.3: v301,50 301.5,50.5 308.73,50.5 308.93,50.3 IC3.11
GND  (via drill 0.3)
  Bottom 0.3: IC4.TAB 347,51 | 347,51 v346,50 | IC4.15 347,51 | IC4.5 348.5,49.8 348.7,50 v350,50 IC4.43 | IC4.35 v350,54 | IC4.23 345.5,54.6 346,54.1 v346,54
  other vias: 357,43 359,56 353,56 357,48 345,56.5 342,49.6 339.1,48.3 342.5,42 299,121 291,121 304,122 286,122 291,105 353,48 349,42 209,104 123,103 37,102 39,103 125,104 211,105 287.5,116 301.9,113 303,110 303,108.8 303,106 291,108 289,127 301,127 303,104.8 287.5,113.3 41.5,112.5 44.5,110 31.5,110 41.5,117 34,105 35,105 127.5,112.5 130.5,110 117.5,110 127.5,117 120,105 121,105 213.5,112.5 216.5,110 203.5,110 213.5,117 206,105 207,105 294.3,45.3 296,47 294,61 296,63 294,80 296,82 294,96 296,96 294,110 316.5,45 316.5,47 321.5,45 321.5,47 211,101 233,105 233,101 100,103 100,101 81,103 81,101 62,103 62,101 147,104 147,101 166,104 166,101 185,104 185,101 252,105 252,101 271,105 271,101 344.6,47 342,54.5 291.5,120.5 298.5,120.5 295,120 297.5,117 292.5,117 183,6 285.9,108 286.1,106 303,56 307,56 300.5,49
  pour Bottom (isolate 0.2): 362,128.5 0,128.5 0,0 362,0
  pour Top (isolate 0.2): 362,128.5 0,128.5 0,0 362,0
N$1
  Bottom 0.508: PRINT.S2 312.48,119 D11.A
N$2
  Bottom 0.508: INSERT.S2 312.67,95 D34.A
N$3
  Bottom 0.508: DELETE.S2 312.62,76 D51.A
N$4
  Bottom 0.508: SCROLL.S2 331.53,119 D12.A
N$5
  Bottom 0.508: HOME.S2 331.72,95 D35.A
N$6
  Bottom 0.508: L_ARR.S2 314,21.27 D93.A
N$7
  Bottom 0.508: END.S2 331.67,76 D52.A
N$8
  Bottom 0.3: IC4.33 350.5,56.15 R26.2
N$9
  Bottom 0.508: D80.A 329,40.57 U_ARR.S2
N$10
  Bottom 0.508: D94.A 328.42,22.1 D-ARR.S2
N$11
  Bottom 0.508: PAUSE.S2 350.58,119 D13.A
N$12
  Bottom 0.508: UP.S2 350.77,95 D36.A
N$13
  Bottom 0.508: DOWN.S2 350.72,76 D53.A
N$14
  Bottom 0.508: <>.S2 41.06,38 D68.A
N$15
  Bottom 0.3: IC1.17 296.55,112.88 295.85,113.58 R5.2
N$16
  Bottom 0.508: R_ARR.S2 352.5,21.66 D95.A
N$17
  Bottom 0.3: IC1.14 292.2,114.16 292,114.36 292,115.8 291.8,116 R1.2
N$18
  Bottom 0.3: IC1.19 299.95,111.6 300.15,111.8 R20.1
N$19
  Bottom 0.2: J4.A5 293.75,121.1 293.55,120.9 292.8,120.9 292.3,120.4 292.3,120 291.8,119.5 R2.2
N$20  (via drill 0.3)
  Top 0.3: v287.5,117.5 290.5,117.5 300.6,107.4 v303,107.4
  Bottom 0.3: R21.2 v303,107.4 | F1.1 278.6,122.7 278.8,122.5 284.5,122.5 286.5,120.5 286.5,117.7 286.7,117.5 v287.5,117.5
  Bottom 0.6: D16.4 125.1,106.1 123,104 118.2,104 118,104.2 118,108.8 118.2,109 120.3,109 120.5,109.2 C5.+ | C7.+ 206.5,109.2 206.3,109 204.2,109 204,108.8 204,104.2 204.2,104 207.5,104 209.2,105.7 210.4,105.7 211.1,106.4 D18.4 | D14.4 39.1,106.1 37,104 32.2,104 32,104.2 32,108.8 32.2,109 34.3,109 34.5,109.2 C3.+
  Bottom 2: F1.1 206.5,125 | 206.5,125 120.5,125 | 120.5,125 41,125 34.5,118.5 J1.VBUS C3.+ | 120.5,125 J2.VBUS C5.+ | 206.5,125 J3.VBUS C7.+
N$21
  Bottom 0.508: ESC.S2 17.21,119 D1.A
N$22
  Bottom 0.508: `/^.S2 17.39,95 D20.A
N$23
  Bottom 0.508: TAB.S2 22.11,76 D37.A
N$24
  Bottom 0.508: CAPSLOCK.S2 24.45,57 D54.A
N$25
  Bottom 0.508: D67.A 31.1,40.78 L-SHIFT.S2 27.16,40 20.8,40 L-SHIFT1.S2
N$26
  Bottom 0.508: L-CTRL.S2 19.58,19 D81.A
N$27
  Bottom 0.508: 1.S2 36.45,95 D21.A
N$28
  Bottom 0.508: Q.S2 45.92,76 D38.A
N$29
  Bottom 0.508: A.S2 50.63,57 D55.A
N$30
  Bottom 0.508: Y/Z.S2 60.11,38 D69.A
N$31
  Bottom 0.508: L-OS.S2 43.4,19 D82.A
N$32
  Bottom 0.508: F_1.S2 55.31,119 D2.A
N$33
  Bottom 0.508: 2.S2 55.49,95 D22.A
N$34
  Bottom 0.508: W.S2 64.97,76 D39.A
N$35
  Bottom 0.508: S.S2 69.68,57 D56.A
N$36
  Bottom 0.508: X.S2 79.16,38 D70.A
N$37
  Bottom 0.508: L-ALT.S2 67.21,19 D83.A
N$38
  Bottom 0.508: F_2.S2 74.36,119 D3.A
N$39
  Bottom 0.508: 3.S2 74.55,95 D23.A
N$40
  Bottom 0.508: E.S2 84.02,76 D40.A
N$41
  Bottom 0.508: D.S2 88.73,57 D57.A
N$42
  Bottom 0.508: C.S2 98.21,38 D71.A
N$43
  Bottom 0.508: F_3.S2 93.41,119 D4.A
N$44
  Bottom 0.508: 4.S2 93.59,95 D24.A
N$45
  Bottom 0.508: R.S2 103.07,76 D41.A
N$46
  Bottom 0.508: F.S2 107.78,57 D58.A
N$47
  Bottom 0.508: V.S2 117.26,38 D72.A
N$48
  Bottom 0.508: F_4.S2 113,118.46 113,107.1 D15.A
N$49
  Bottom 0.508: 5.S2 112.64,95 D25.A
N$50
  Bottom 0.508: T.S2 122.12,76 D42.A
N$51
  Bottom 0.508: G.S2 126.83,57 D59.A
N$52
  Bottom 0.508: B.S2 136.31,38 D73.A
N$53
  Bottom 0.508: SPACE.S2 138.65,19 140.9,19 D86.A
N$54
  Bottom 0.508: F_5.S2 141.03,119 D5.A
N$55
  Bottom 0.508: 6.S2 131.69,95 D26.A
N$56
  Bottom 0.508: Z/Y.S2 141.17,76 D43.A
N$57
  Bottom 0.508: H.S2 145.88,57 D60.A
N$58
  Bottom 0.508: N.S2 155.36,38 D74.A
N$59
  Bottom 0.508: F_6.S2 160.08,119 D6.A
N$60
  Bottom 0.508: 7.S2 150.75,95 D27.A
N$61
  Bottom 0.508: U.S2 160.22,76 D44.A
N$62
  Bottom 0.508: J.S2 164.93,57 D61.A
N$63
  Bottom 0.508: M.S2 174.41,38 D75.A
N$64
  Bottom 0.508: F_7.S2 179.13,119 D7.A
N$65
  Bottom 0.508: 8.S2 169.79,95 D28.A
N$66
  Bottom 0.508: I.S2 179.27,76 D45.A
N$67
  Bottom 0.508: K.S2 183.98,57 D62.A
N$68
  Bottom 0.508: </,.S2 193.46,38 D76.A
N$69
  Bottom 0.508: D17.A 198.5,107.2 198.5,118.68 F_8.S2
N$70
  Bottom 0.508: 9.S2 188.84,95 D29.A
N$71
  Bottom 0.508: O.S2 198.32,76 D46.A
N$72
  Bottom 0.508: L.S2 203.03,57 D63.A
N$73
  Bottom 0.508: >/..S2 212.51,38 D77.A
N$74
  Bottom 0.508: R-ALT.S2 210.08,19 D89.A
N$75
  Bottom 0.508: F_9.S2 226.76,119 D8.A
N$76
  Bottom 0.508: 0.S2 207.9,95 D30.A
N$77
  Bottom 0.508: P.S2 217.37,76 D47.A
N$78
  Bottom 0.508: ..S2 222.08,57 D64.A
N$79
  Bottom 0.508: //-.S2 231.56,38 D78.A
N$80
  Bottom 0.508: R-OS.S2 233.9,19 D90.A
N$81
  Bottom 0.508: F_10.S2 245.81,119 D9.A
N$82
  Bottom 0.508: -/ß.S2 226.94,95 D31.A
N$83
  Bottom 0.508: [/Ü.S2 236.42,76 D48.A
N$84
  Bottom 0.508: ,/Ä.S2 241.13,57 D65.A
N$85
  Bottom 0.508: F_11.S2 264.86,119 D10.A
N$86
  Bottom 0.508: =/´.S2 246,95 D32.A
N$87
  Bottom 0.508: ]/+.S2 255.47,76 D49.A
N$88
  Bottom 0.508: MENU.S2 257.71,19 D91.A
N$89
  Bottom 0.508: F_12.S2 284,118.91 284,112.1 284.5,111.6 284.5,106.5 284,106 D19.A
N$90
  Bottom 0.508: BACKSPACE.S2 274.57,95 D33.A
N$91
  Bottom 0.508: \\/#.S2 279.28,76 D50.A
N$92
  Bottom 0.508: RETURN.S2 273.19,55.9 D66.A
N$93
  Bottom 0.508: R-SHIFT.S2 268.28,37 D79.A
N$94
  Bottom 0.508: R-CTRL.S2 281.52,19 D92.A
N$95
  Bottom 0.3: C14.2 R21.1 300.15,107.32 299.95,107.12 IC1.26
N$96
  Bottom 0.6: J4.VBUS2 297.45,122.55 296,124 | J4.VBUS1 292.55,122.55 294,124
  Bottom 1.5: F1.2 293,125 294,124 296,124 297,125 R9.2
N$97  (via drill 0.3)
  Top 0.2: v291,110.3 289.6,110.3 282.1,102.8 124.2,102.8 123.8,103.2 123.8,109.1 v123,109.9
  Bottom 0.2: IC1.8 291.02,110.32 v291,110.3
  Bottom 0.6: D16.2 123,109.05 v123,109.9 R14.1
N$98  (via drill 0.3)
  Top 0.2: v290.49,110.99 289.69,110.99 281.9,103.2 124.4,103.2 124.2,103.4 124.2,109.1 v125,109.9
  Bottom 0.2: IC1.9 292.26,111 v290.5,111 v290.49,110.99
  Bottom 0.6: D16.3 125,109.05 v125,109.9 R15.1
N$99  (via drill 0.3)
  Top 0.2: v290.5,109.7 290.5,109.6 282.9,102 38.4,102 38.2,102.2 38.2,109.1 v39,109.9
  Bottom 0.2: IC1.7 292.28,109.7 v290.5,109.7
  Bottom 0.6: D14.3 39,109.05 v39,109.9 R12.1
N$100  (via drill 0.3)
  Top 0.2: v291,109.1 290.6,109.1 283.1,101.6 38.2,101.6 37.8,102 37.8,109.1 v37,109.9
  Bottom 0.2: IC1.6 291.06,109.04 v291,109.1
  Bottom 0.6: D14.2 37,109.05 v37,109.9 R11.1
N$101
  Bottom 0.2: R4.2 293.75,118 293.4,118 292.8,118.6 292.8,120.1 293.2,120.5 294.05,120.5 294.25,120.7 J4.B7 294.25,122.6 294.45,122.8 295.05,122.8 295.25,122.6 J4.A7
N$102
  Bottom 0.2: R3.2 293.75,118.6 293.4,118.6 293.2,118.8 293.2,119.9 293.4,120.1 294.25,120.1 294.75,120.6 294.75,120.7 | 294.75,120.7 J4.A6 | 294.75,120.7 295.55,120.7 295.75,120.9 J4.B6
N$103
  Bottom 0.3: IC1.3 291.22,107.12 290.6,106.5 288.25,106.5 X1.3 287.35,108.7 C9.1
N$104
  Bottom 0.2: IC1.15 297.8,114.06 298.3,114.06 298.6,114.36 298.6,117.9 298.4,118.1 297,118.1 296.5,117.6 R4.1
N$105
  Bottom 0.2: IC1.16 297.8,113.62 298.4,113.62 299,114.22 299,118.1 298.6,118.5 297,118.5 296.5,119 R3.1
N$106  (via drill 0.3)
  Top 0.2: v294.9,45.9 295,45.8 350,45.8 v350.1,45.9
  Bottom 0.2: IC1.4 292.7,107.76 292.8,107.86 293.8,107.86 294.3,107.36 294.3,99 294.8,98.5 294.8,46 v294.9,45.9 | IC4.3 349.5,47.4 350.1,46.8 v350.1,45.9
N$107  (via drill 0.3)
  Top 0.2: v349.5,46.5 349.2,46.2 295.7,46.2 v295.4,46.5
  Bottom 0.2: IC1.5 292.7,108.4 292.8,108.3 294,108.3 294.7,107.6 294.7,99.2 295.2,98.7 295.2,46.7 v295.4,46.5 | IC4.4 349,47.3 349.5,46.8 v349.5,46.5
N$108
  Bottom 0.3: IC1.18 298.8,112.24 299,112.44 299,112.85 R19.2 C2.2 R7.1
N$109
  Bottom 0.2: IC4.17 339.25,52 X2.3
  Bottom 0.3: X2.3 338.65,53.2 C17.1
N$110
  Bottom 0.2: IC4.16 341.05,51.5
  Bottom 0.3: 341.05,51.5 X2.1 340.65,49.8 C18.1
N$111
  Bottom 0.3: IC4.6 348,47.55 348.5,47.05 C20.2
N$112  (1 unrouted)
  Bottom 1: R16.1 203.5,118.93 J3.SHLD2 | C8.2 216.5,118.93 J3.SHLD1
N$113  (1 unrouted)
  Bottom 1: R13.1 117.5,118.93 J2.SHLD2 | C6.2 130.5,118.93 J2.SHLD1
N$114  (1 unrouted)
  Bottom 1: R10.1 31.5,118.93 J1.SHLD2 | C4.2 44.5,118.93 J1.SHLD1
N$115  (7 unrouted)
  Bottom 0.6: J4.SHLD2 299.32,122.2 299.52,122 R8.1 | J4.SHLD3 290.68,122.2 290.48,122 C1.2
N$116
  Bottom 0.2: J4.B5 296.75,120.25 297.5,119.5 R6.2
N$117  (via drill 0.3)
  Top 0.3: v353.3,49.5 v355.2,51.4
  Bottom 0.3: IC4.42 352.8,50.5 353.3,50 v353.3,49.5 | v355.2,51.4 356.95,51.4 C19.2
N$118
  Bottom 0.3: IC1.2 291.48,106.48 290.6,105.6 X1.1 289.65,104.3 C16.1
N$119
  Bottom 0.3: R32.2 316.5,38.23 LED6.K
N$120
  Bottom 0.3: R31.2 315,34.23 LED5.K
N$121
  Bottom 0.3: R30.2 312.6,35.4 313,35 313,29.73 LED4.K
N$122
  Bottom 0.3: R29.2 309.5,38.23 LED3.K
N$123
  Bottom 0.3: R28.2 308,34.23 LED2.K
N$124
  Bottom 0.3: R27.2 305.5,35.5 306,35 306,29.73 LED1.K
N$125
  Bottom 0.3: IC3.12 308.27,47.73 311.5,44.5 314.7,44.5 316.5,42.7 R32.1
N$126
  Bottom 0.3: IC3.14 306.98,48.02 311.3,43.7 314,43.7 315,42.7 R31.1
N$127
  Bottom 0.3: IC3.16 305.68,48.33 311,43 312.3,43 312.6,42.7 R30.1
N$128
  Bottom 0.3: IC3.17 305.02,47.98 309.5,43.5 R29.1
N$129
  Bottom 0.3: IC3.19 303.73,48.27 308,44 R28.1
N$130
  Bottom 0.3: IC3.20 303.07,47.92 305.5,45.5 R27.1
N$131
  Bottom 0.6: J3.D- R17.2
N$132
  Bottom 0.6: J3.D+ R18.2
N$133
  Bottom 0.6: R14.2 J2.D-
N$134
  Bottom 0.6: R15.2 J2.D+
N$135
  Bottom 0.6: R11.2 J1.D-
N$136
  Bottom 0.6: R12.2 J1.D+
N$137
  Bottom 0.508: LS2.S2 114.83,19 D85.A
N$138
  Bottom 0.508: LS1.S2 91.02,19 D84.A
N$139  (via drill 3.2 pad 6)
  other vias: 81.4,83.7
N$140
  Bottom 0.508: RS2.S2 185.9,19.2 186.1,19 D88.A
N$141
  Bottom 0.508: RS1.S2 162.46,19 D87.A
R1  (via drill 0.3)
  Top 0.508: ESC.S1 10.48,121.28 13.02,123.83 46.04,123.83 48.58,121.28 | 48.58,121.28 F_1.S1 | F_2.S1 67.63,121.28 | 67.63,121.28 65.09,123.83 51.12,123.83 48.58,121.28 | F_3.S1 86.68,121.28 | 86.68,121.28 84.14,123.83 70.17,123.83 67.63,121.28 | F_4.S1 105.73,121.28 | 105.73,121.28 103.19,123.83 89.22,123.83 86.68,121.28 | F_5.S1 134.3,121.28 | 134.3,121.28 131.76,123.83 108.27,123.83 105.73,121.28 | F_6.S1 153.35,121.28 | 153.35,121.28 150.81,123.83 136.84,123.83 134.3,121.28 | F_7.S1 172.4,121.28 | 172.4,121.28 169.86,123.83 155.89,123.83 153.35,121.28 | F_8.S1 191.45,121.28 | 191.45,121.28 188.91,123.83 174.94,123.83 172.4,121.28 | F_9.S1 220.03,121.28 | 220.03,121.28 217.49,123.83 193.99,123.83 191.45,121.28 | F_10.S1 239.08,121.28 | 239.08,121.28 236.54,123.83 222.57,123.83 220.03,121.28 | F_11.S1 258.13,121.28 | 258.13,121.28 255.59,123.83 241.62,123.83 239.08,121.28 | F_12.S1 277.18,121.28 | 277.18,121.28 274.64,123.83 260.67,123.83 258.13,121.28 | 277.18,121.28 280.89,125 302,125 305.75,121.25 | 305.75,121.25 PRINT.S1 | 305.75,121.25 308.31,123.8 322.2,123.8 324.8,121.2 | 324.8,121.2 SCROLL.S1 | 324.8,121.2 327.4,123.8 341.2,123.8 343.85,121.15 | 343.85,121.15 PAUSE.S1 | 343.85,121.15 346.5,123.8 351.2,123.8 357,118 v357,56
  Bottom 0.3: IC4.39 355.8,52 357,53.2 v357,56
R2  (via drill 0.3)  (1 unrouted)
  Top 0.508: `/^.S1 10.48,97.47 13.02,100.01 26.99,100.01 29.53,97.47 | 1.S1 29.53,97.47 | 29.53,97.47 32.07,100.01 46.04,100.01 48.58,97.47 | 2.S1 48.58,97.47 | 48.58,97.47 51.12,100.01 65.09,100.01 67.63,97.47 | 3.S1 67.63,97.47 | 67.63,97.47 70.17,100.01 84.14,100.01 86.68,97.47 | 4.S1 86.68,97.47 | 86.68,97.47 89.22,100.01 103.19,100.01 105.73,97.47 | 5.S1 105.73,97.47 | 105.73,97.47 108.27,100.01 122.22,100.01 124.78,97.46 6.S1 | 124.78,97.47 127.32,100.01 141.29,100.01 143.83,97.47 | 7.S1 143.83,97.47 | 143.83,97.47 146.37,100.01 160.34,100.01 162.88,97.47 | 8.S1 162.88,97.47 | 162.88,97.47 165.42,100.01 179.39,100.01 181.93,97.47 | 9.S1 181.93,97.47 | 181.93,97.47 184.47,100.01 198.44,100.01 200.98,97.47 | 0.S1 200.98,97.47 | 200.98,97.47 203.52,100.01 217.49,100.01 220.03,97.47 | -/ß.S1 220.03,97.47 | 220.03,97.47 222.57,100.01 236.54,100.01 239.08,97.47 | =/´.S1 239.08,97.47 | 239.08,97.47 241.62,100.01 265.11,100.01 267.65,97.47 | BACKSPACE.S1 267.65,97.47 | 267.65,97.47 270.18,100 303,100 305.75,97.25 | 305.75,97.25 INSERT.S1 | 305.75,97.25 308.5,100 322,100 324.8,97.2 | 324.8,97.2 HOME.S1 | 324.8,97.2 327.61,100 341,100 343.85,97.15 | 343.85,97.15 UP.S1 | 343.85,97.15 346.7,100 355.1,100 356,99.1 v356,56
  Bottom 0.3: IC4.38 355,52.5 356,53.5 v356,56
R3  (via drill 0.3)
  Top 0.508: TAB.S1 15.24,78.42 17.78,80.96 36.51,80.96 39.05,78.42 | Q.S1 39.05,78.42 | 39.05,78.42 41.59,80.96 55.56,80.96 58.1,78.42 | W.S1 58.1,78.42 | 58.1,78.42 60.64,80.96 74.61,80.96 77.15,78.42 | E.S1 77.15,78.42 | 77.15,78.42 79.69,80.96 93.66,80.96 96.2,78.42 | R.S1 96.2,78.42 | 96.2,78.42 98.74,80.96 112.71,80.96 115.25,78.42 | T.S1 115.25,78.42 | 115.25,78.42 117.79,80.96 131.76,80.96 134.3,78.42 | Z/Y.S1 134.3,78.42 | 134.3,78.42 136.84,80.96 150.81,80.96 153.35,78.42 | U.S1 153.35,78.42 | 153.35,78.42 155.89,80.96 169.86,80.96 172.4,78.42 | I.S1 172.4,78.42 | 172.4,78.42 174.94,80.96 188.91,80.96 191.45,78.42 | O.S1 191.45,78.42 | 191.45,78.42 193.99,80.96 207.96,80.96 210.5,78.42 | P.S1 210.5,78.42 | 210.5,78.42 213.04,80.96 227.01,80.96 229.55,78.42 | [/Ü.S1 229.55,78.42 | 229.55,78.42 232.09,80.96 246.06,80.96 248.6,78.42 | ]/+.S1 248.6,78.42 | 248.6,78.42 251.14,80.96 255.04,80.96 257,79 262,79 264,81 269.9,81 272.42,78.42 | \\/#.S1 272.42,78.42 | 272.42,78.42 274.99,81 279,81 281,79 286,79 288,81 303,81 305.75,78.25 305.75,78.2 | 305.75,78.2 DELETE.S1 | 305.75,78.2 308.55,81 322,81 324.8,78.2 | 324.8,78.2 END.S1 | 324.8,78.2 327.61,81 341,81 343.85,78.15 | 343.85,78.15 DOWN.S1 | 343.85,78.15 346.7,81 354,81 355,80 v355,56
  Bottom 0.3: IC4.37 354.2,53 355,53.8 v355,56
R4  (via drill 0.3)
  Top 0.508: CAPSLOCK.S1 17.63,59.37 20.17,61.91 41.27,61.91 43.81,59.37 | A.S1 43.81,59.37 | 43.81,59.37 46.35,61.91 60.33,61.91 62.87,59.37 | S.S1 62.87,59.37 | 62.87,59.37 65.41,61.91 79.38,61.91 81.92,59.37 | D.S1 81.92,59.37 | 81.92,59.37 84.45,61.91 98.42,61.91 100.97,59.37 | F.S1 100.97,59.37 | 100.97,59.37 103.5,61.91 117.47,61.91 120.02,59.37 | G.S1 120.02,59.37 | 120.02,59.37 122.56,61.91 136.53,61.91 139.06,59.37 | H.S1 139.06,59.37 | 139.06,59.37 141.6,61.91 155.57,61.91 158.12,59.37 | J.S1 158.12,59.37 | 158.12,59.37 160.66,61.91 174.62,61.91 177.16,59.37 | K.S1 177.16,59.37 | 177.16,59.37 179.71,61.91 193.68,61.91 196.22,59.37 | L.S1 196.22,59.37 | 196.22,59.37 198.75,61.91 212.72,61.91 215.26,59.37 | ..S1 215.26,59.37 | 215.26,59.37 217.81,61.91 231.78,61.91 234.31,59.37 | ,/Ä.S1 234.31,59.37 | 234.31,59.37 236.85,61.91 262.74,61.91 265.28,59.37 | RETURN.S1 265.28,59.37 | 265.28,59.37 267.9,62 353,62 354,61 v354,56
  Bottom 0.3: IC4.36 353.5,53.5 354,54 v354,56
R5  (via drill 0.3)
  Top 0.508: L-SHIFT.S1 22.39,40.32 24.93,42.86 31.14,42.86 34.29,39.71 | Y/Z.S1 53.34,40.32 | 53.34,40.32 55.88,42.86 69.85,42.86 72.39,40.32 | X.S1 72.39,40.32 | 72.39,40.32 74.93,42.86 88.9,42.86 91.44,40.32 | C.S1 91.44,40.32 | 91.44,40.32 93.98,42.86 107.95,42.86 110.49,40.32 | V.S1 110.49,40.32 | 110.49,40.32 113.03,42.86 127,42.86 129.54,40.32 | B.S1 129.54,40.32 | 129.54,40.32 132.08,42.86 146.05,42.86 148.59,40.32 | N.S1 148.59,40.32 | 148.59,40.32 151.13,42.86 165.1,42.86 167.64,40.32 | M.S1 167.64,40.32 | 167.64,40.32 170.18,42.86 184.15,42.86 186.69,40.32 | </,.S1 186.69,40.32 | 186.69,40.32 189.23,42.86 203.2,42.86 205.74,40.32 | >/..S1 205.74,40.32 | 205.74,40.32 208.28,42.86 222.25,42.86 224.79,40.32 | //-.S1 224.79,40.32 | 224.79,40.32 227.33,42.86 253.07,42.86 254.94,41 259.81,41 260.51,40.3 | R-SHIFT.S1 260.51,40.3 | 260.51,40.3 260.51,40.32 260.52,40.32 263.1,42.9 277.1,42.9 279,41 283,41 285,43 322,43 324.8,40.2 324.8,39.7 | 53.34,40.32 50.8,42.86 37.44,42.86 34.29,39.71 | 324.8,39.7 U_ARR.S1 | 324.8,39.7 328.1,43 353,43 354,44 v354,48 | 34.29,39.71 <>.S1
  Bottom 0.3: IC4.41 353.4,51 354,50.4 v354,48
  Bottom 0.508: L-SHIFT.S1 18.12,35.88 17,37 13.99,37 L-SHIFT1.S1
R6  (via drill 0.3)
  Top 0.508: L-CTRL.S1 12.87,18.87 17.8,23.81 34.14,23.81 36.68,21.27 | L-OS.S1 36.68,21.27 | L-ALT.S1 60.49,21.27 | 60.49,21.27 63.03,23.81 77.32,23.81 LS1.S1 91.28,23.8 105.7,23.8 108.11,21.39 | SPACE.S1 131.93,21.27 | 131.93,21.27 134.47,23.81 153.19,23.81 155.74,21.26 | R-ALT.S1 203.37,21.27 | 203.37,21.27 205.91,23.81 224.64,23.81 227.18,21.27 | R-OS.S1 227.18,21.27 | 227.18,21.27 229.72,23.81 248.45,23.81 250.99,21.27 | MENU.S1 250.99,21.27 | R-CTRL.S1 274.8,21.27 | 274.8,21.27 272.26,23.81 255.83,23.81 253.29,21.27 250.99,21.27 | 203.37,21.27 200.82,23.81 200.81,23.8 181.91,23.8 179.55,21.45 | 60.49,21.27 57.95,23.81 41.82,23.81 39.28,21.27 36.68,21.27 | 305.75,21.25 L_ARR.S1 | 305.75,21.25 303.2,23.8 280.83,23.8 278.3,21.27 274.8,21.27 | 305.75,21.25 308.31,23.8 322.2,23.8 324.8,21.2 | 324.8,21.2 D-ARR.S1 | 324.8,21.2 327.4,23.8 341.2,23.8 343.75,21.25 | R_ARR.S1 343.85,21.15 343.75,21.25 | 343.75,21.25 346.3,23.8 354,23.8 355,24.8 v355,48 | 155.74,21.26 RS1.S1 | 155.74,21.26 158.28,23.8 177.2,23.8 179.55,21.45 | 179.55,21.45 RS2.S1 | 108.11,21.39 LS2.S1 | 108.11,21.39 110.53,23.8 129.4,23.8 131.93,21.27
  Bottom 0.3: IC4.40 354,51.5 355,50.5 v355,48
RST  (via drill 0.3)
  Top 0.3: v342.5,44.5 v352.5,44.5 | v342.5,47.5 v329.6,47.5
  Bottom 0.3: IC4.13 343.7,50 342.5,48.8 v342.5,47.5 v342.5,44.5 | ISP.RST 360.06,44.5 356.05,44.5 355.85,44.7 | v329.6,47.5 328.99,47.5 328.79,47.7 RESET.2 RESET.1 | v352.5,44.5 355.65,44.5 355.85,44.7 | 355.85,44.7 R33.2
SCL  (via drill 0.3)
  Top 0.3: v342.5,52.6 312.97,52.6 312.6,52.97 DISPLAY.3
  Bottom 0.3: IC4.18 342.6,52.5 v342.5,52.6 | R24.2 314.88,52.97 DISPLAY.3 303.93,52.97 303.73,53.17 IC3.2
SCL_HUB
  Bottom 0.2: IC1.23 296.3,109.04 296.1,108.84 296.1,101.83 296.3,101.64 IC2.6
SDA  (via drill 0.3)
  Top 0.3: v342.5,53.5 314.51,53.5 312.5,55.51 DISPLAY.4
  Bottom 0.3: IC4.19 343.1,53 342.6,53.5 v342.5,53.5 | R25.2 317.5,55.31 317.3,55.51 DISPLAY.4 309.39,53.6 305.23,53.6 305.02,53.8 IC3.4
SDA_HUB
  Bottom 0.2: IC1.27 296.7,106.48 296.5,106.28 296.5,103.11 296.7,102.91 IC2.5
SL_LED_A  (via drill 0.3)
  Top 0.3: SCROLL.A 327.34,106.32 326.02,105 318,105 v317.5,104.5
  Bottom 0.3: v317.5,104.5 317.5,103.8 317.7,103.6 317.7,60.4 316.8,59.5 R23.1
SL_LED_C  (via drill 0.3)
  Top 0.3: SCROLL.K 329.88,106.92 327.46,104.5 318.8,104.5 v318.3,104
  Bottom 0.3: v318.3,104 318.3,60.3 317,59 309.12,59 308.93,58.8 IC3.10
USB1N  (via drill 0.3)
  Top 0.2: v291,111.6 288.7,111.6 281.1,104 210.2,104 209.8,104.4 209.8,109.1 v209,109.9
  Bottom 0.2: IC1.10 v291,111.6
  Bottom 0.6: D18.2 209,109.05 v209,109.9 R17.1
USB1P  (via drill 0.3)
  Top 0.2: v290.5,112.3 288.8,112.3 280.9,104.4 210.4,104.4 210.2,104.6 210.2,109.1 v211,109.9
  Bottom 0.2: IC1.11 290.56,112.24 v290.5,112.3
  Bottom 0.6: D18.3 211,109.05 v211,109.9 R18.1
VCC  (via drill 0.3)
  Top 0.3: v352.5,49.5 v352.49,49.51 | ISP.VCC 357.96,39.46 v357,38.5 | 347.8,48 347.6,47.8
  Top 0.6: 351,47.8 350.8,48 347.8,48 | 351,47.8 v351,47 | v347.6,47 347.6,47.8 347.4,48 343.9,48 343,48.9 v343,50.5 342.93,50.43 DISPLAY.2 | 351,47.8 351.2,48 351.6,48 352.5,48.9 v352.5,49.5 v352.5,54.5 352.5,55.1 351.1,56.5 v345.8,56.5 | LED4.A 309.73,31.5 LED5.A 311.73,36 LED6.A 311.73,40 308.73,40 LED3.A 304.73,36 LED2.A 302.73,31.5 LED1.A
  Bottom 0.3: IC4.34 v352.5,54.5 | v352.49,49.51 351.36,49.51 IC4.44 | IC4.2 350,47.6 350.6,47 v351,47 351,45.7 351.1,45.6 | IC4.7 347.5,47.1 v347.6,47 | IC4.14 v343,50.5 | IC4.24 346,56.3 v345.8,56.5 | 351.1,45.6 351.2,45.5 R33.1 | v357,38.5 354.5,38.5 354,38 352.9,38 350,40.9 350,44.5 351.1,45.6 | IC1.20 300.1,110.96 | 300.1,110.96 302.3,110.96 303,111.66 | 306,124.95 R9.1 | C12.2 300.15,110.91 300.1,110.96 | IC3.5 305.68,56.8 305.48,57 | 305.48,57 301.3,57 | R23.2 305.9,59.5 305.7,59.3 305.7,57.2 305.5,57 305.48,57 | R22.2 300.35,53.2 301.3,53.2
  Bottom 0.6: 306,124.95 306,122 303,119 303,116.6 | 303,111.66 303,111.9 | 303,111.9 303,116.6 | R7.2 303,116.6 | 303,111.9 304,110.9 304,102 301.3,99.3 301.3,57 301.3,55 | 301.3,55 301.3,53.2 301.3,52.6 301.97,51.93 309.1,51.93 310.6,50.43 DISPLAY.2 315.28,50.43 R24.1 R25.1 | 301.3,55 298.2,55 298,54.8 298,48 301,45 301,30.73 LED1.A

## Text on the board
Bottom: //HUB KEYBOARD\\\\ | 200513kw
tNames: JLCJLCJLCJLC | ;/Ö
bNames: SCROLL / LOCK / LED | 0x70 | CAPS / LOCK / LED
bStop: //HUB KEYBOARD\\\\ | ISP